# EAGLE design schematic (EAGLE 9.6.2)
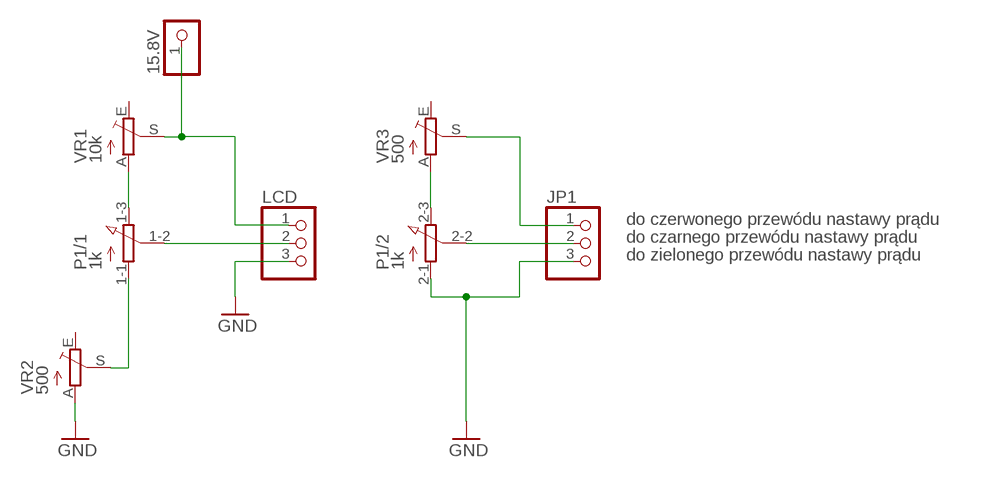
[diagram p0: schematic, sheet 1]

## Parts
15.8V  PINHD-1X1  [1X01]
JP1  PINHD-1X3  [1X03]
LCD  PINHD-1X3  [1X03]
P1  1k  3RP/1610G  [3RP/1610G]
VR1  10k  TRIM_EU-RJ9W  [RJ9W]
VR2  500  TRIM_EU-RJ9W  [RJ9W]
VR3  500  TRIM_EU-RJ9W  [RJ9W]

## Nets
GND: JP1.3 LCD.3 P1.2-1(/2:A) VR2.A
N$1: P1.2-3(/2:E) VR3.A
N$2: JP1.1 VR3.S
N$3: JP1.2 P1.2-2(/2:S)
N$4: P1.1-1(/1:A) VR2.S
N$5: P1.1-3(/1:E) VR1.A
N$6: 15.8V.1 LCD.1 VR1.S
N$8: LCD.2 P1.1-2(/1:S)
Unconnected: VR1.E VR2.E VR3.E

## Notes on the sheet
- do czerwonego przewódu nastawy prądu
- do czarnego przewódu nastawy prądu
- do zielonego przewódu nastawy prądu

## Library data of the parts
15.8V = pinhead:PINHD-1X1: PIN HEADER
JP1 LCD = pinhead:PINHD-1X3: PIN HEADER
P1 = pot:3RP/1610G: 16mm Potentiometer two level Source: http://www.alphapotentiometers.net/html/16mm_pot_2.html
VR1-VR3 = pot:TRIM_EU-: POTENTIOMETER

## Board
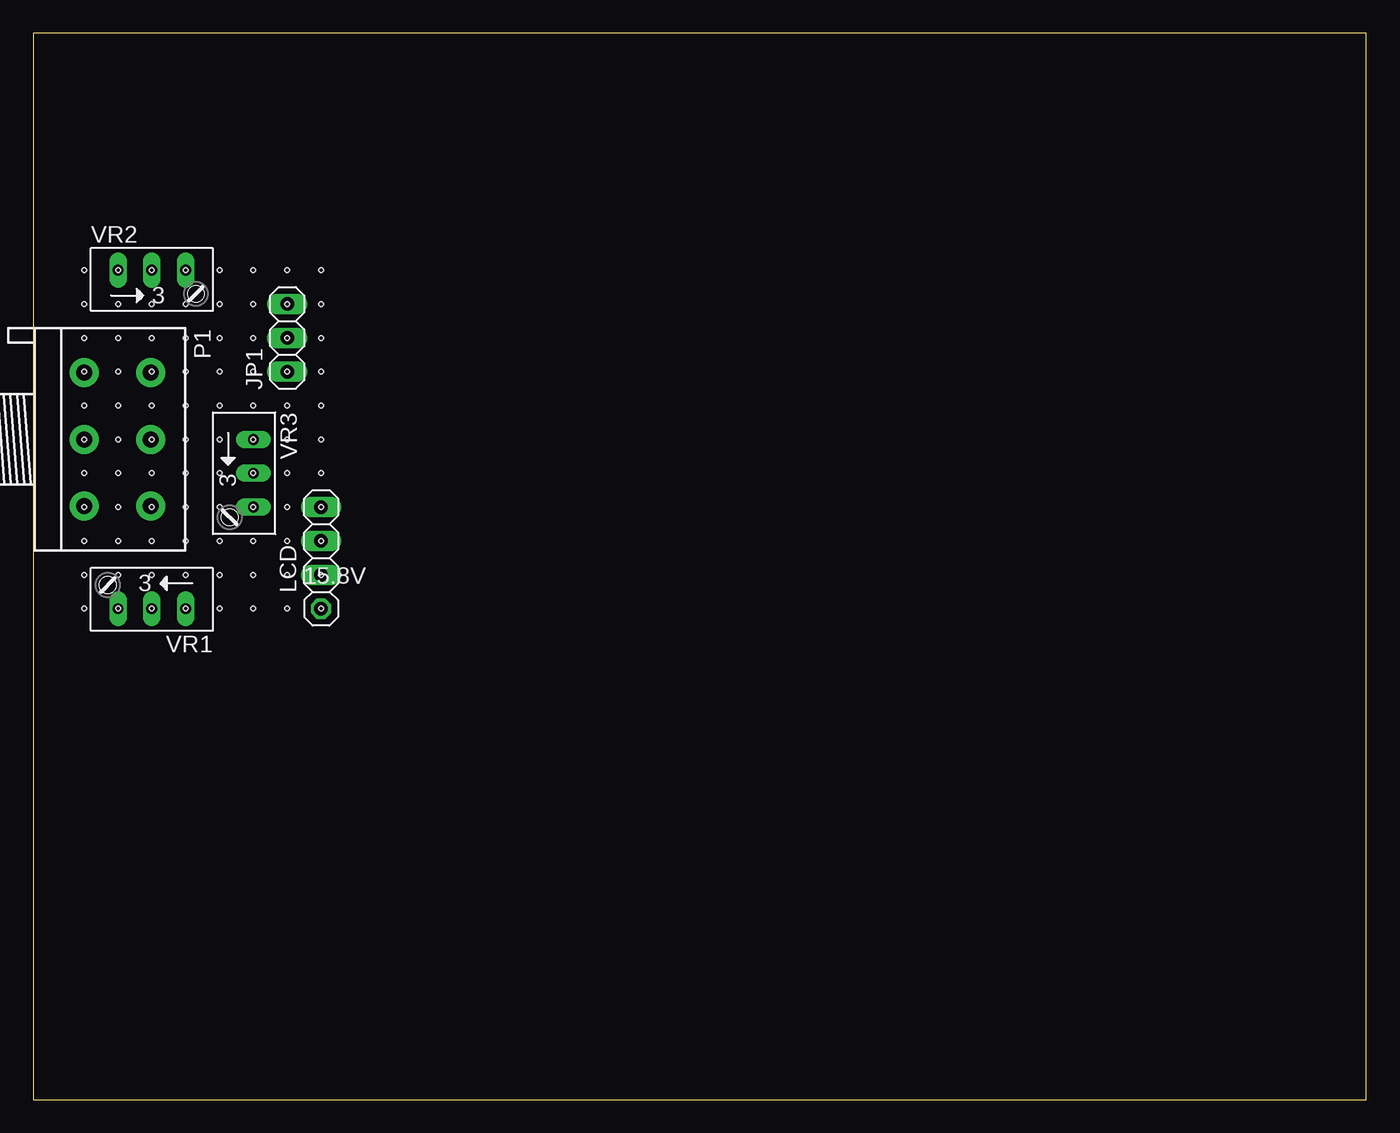
[diagram p1: board, top side]
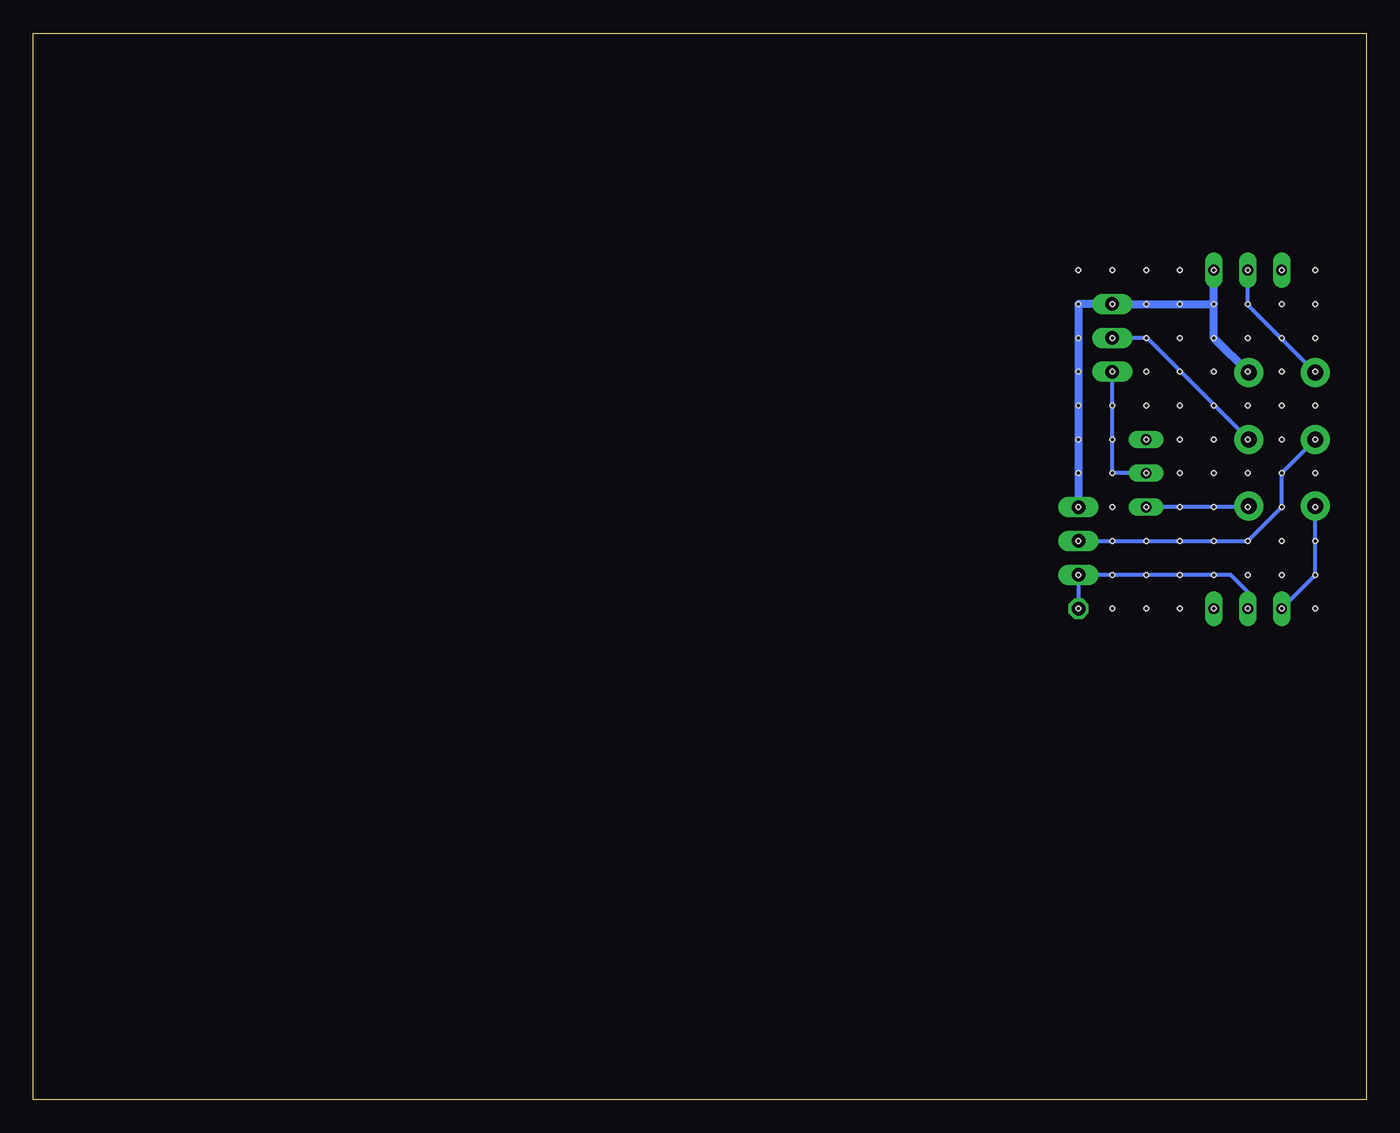
[diagram p2: board, bottom side, seen from below]

Size 100 x 80 mm. Coordinates in mm from the lower left corner, seen from the top.
Outline: 0,0 100,0 100,80 0,80 0,0
Copper layers (1*16): Top 0.035mm / dielectric 1.5mm / Bottom 0.035mm
Design rules "default": minimum track width 6mil, minimum drill 0.35mm, track to track 6mil, track to pad 6mil, pad to pad 6mil, via to via 6mil, smd to smd 6mil, copper to edge 40mil, drill to drill 6mil, minimum pad ring 10mil, minimum via ring 8mil, stop-mask expansion 4mil, vias tented up to drill 0mil, thermal gap 10mil
Holes 0.35 mm at 3.81,54.61 8.89,54.61 13.97,54.61 19.05,54.61 3.81,49.53 8.89,49.53 13.97,49.53 19.05,49.53 3.81,44.45 8.89,44.45 13.97,44.45 19.05,44.45 3.81,39.37 8.89,39.37 13.97,39.37 19.05,39.37 3.81,59.69 8.89,59.69 13.97,59.69 19.05,59.69 3.81,62.23 6.35,62.23 8.89,62.23 11.43,62.23 13.97,62.23 16.51,62.23 19.05,62.23 21.59,62.23 21.59,59.69 16.51,59.69 11.43,59.69 6.35,59.69 3.81,57.15 6.35,57.15 8.89,57.15 11.43,57.15 13.97,57.15 16.51,57.15 19.05,57.15 21.59,57.15 21.59,54.61 16.51,54.61 11.43,54.61 6.35,54.61 3.81,52.07 6.35,52.07 8.89,52.07 11.43,52.07 13.97,52.07 16.51,52.07 19.05,52.07 21.59,52.07 21.59,49.53 16.51,49.53 11.43,49.53 6.35,49.53 3.81,46.99 6.35,46.99 8.89,46.99 11.43,46.99 13.97,46.99 16.51,46.99 19.05,46.99 21.59,46.99 6.35,44.45 11.43,44.45 16.51,44.45 21.59,44.45 3.81,41.91 6.35,41.91 8.89,41.91 11.43,41.91 13.97,41.91 16.51,41.91 19.05,41.91 21.59,41.91 21.59,39.37 16.51,39.37 11.43,39.37 6.35,39.37 3.81,36.83 6.35,36.83 8.89,36.83 11.43,36.83 13.97,36.83 16.51,36.83 19.05,36.83 21.59,36.83

### Footprints (pad centres in the part's own frame; a part is rotated, then mirrored left to right if it is on the bottom)
1X01 = drill 1.016 octagon: 1 0,0
1X03 = drill 1.016 long: 1 -2.54,0; 2 0,0; 3 2.54,0
3RP/1610G = drill 1.2 pad 2.184: 1-1 -5,0; 1-2 0,0; 1-3 5,0; 2-1 -5,5; 2-2 0,5; 2-3 5,5
RJ9W = drill 0.813 long: A 2.54,0.635; E -2.54,0.635; S 0,0.635

### Placement (x,y rotation side)
15.8V  21.59,36.83 0 top
JP1  19.05,57.15 90 top
LCD  21.59,41.91 90 top
P1  3.81,49.53 270 top
VR1  8.89,37.47 180 top
VR2  8.89,61.59 0 top
VR3  15.88,46.99 270 top

### Tracks (layer width: path | path; a pad name or v marks a point on that pad's centre or on a via)
GND
  Bottom 0.61: P1.2-1 11.43,57.15 11.43,59.69 | 11.43,59.69 JP1.3 21.59,59.69 LCD.3 | 11.43,59.69 VR2.A
N$1
  Bottom 0.305: P1.2-3 8.89,44.45 VR3.A
N$2
  Bottom 0.305: VR3.S 19.05,46.99 JP1.1
N$3
  Bottom 0.305: P1.2-2 16.43,57.15 JP1.2
N$4
  Bottom 0.305: P1.1-1 8.89,59.61 VR2.S
N$5
  Bottom 0.305: VR1.A 3.81,39.37 P1.1-3
N$6
  Bottom 0.305: VR1.S 8.89,38.1 10.16,39.37 LCD.1 15.8V.1
N$8
  Bottom 0.305: 20.32,41.91 LCD.2 8.89,41.91 6.35,44.45 6.35,46.99 P1.1-2